# Altium schematic sheet onV1.SchDoc
size A2
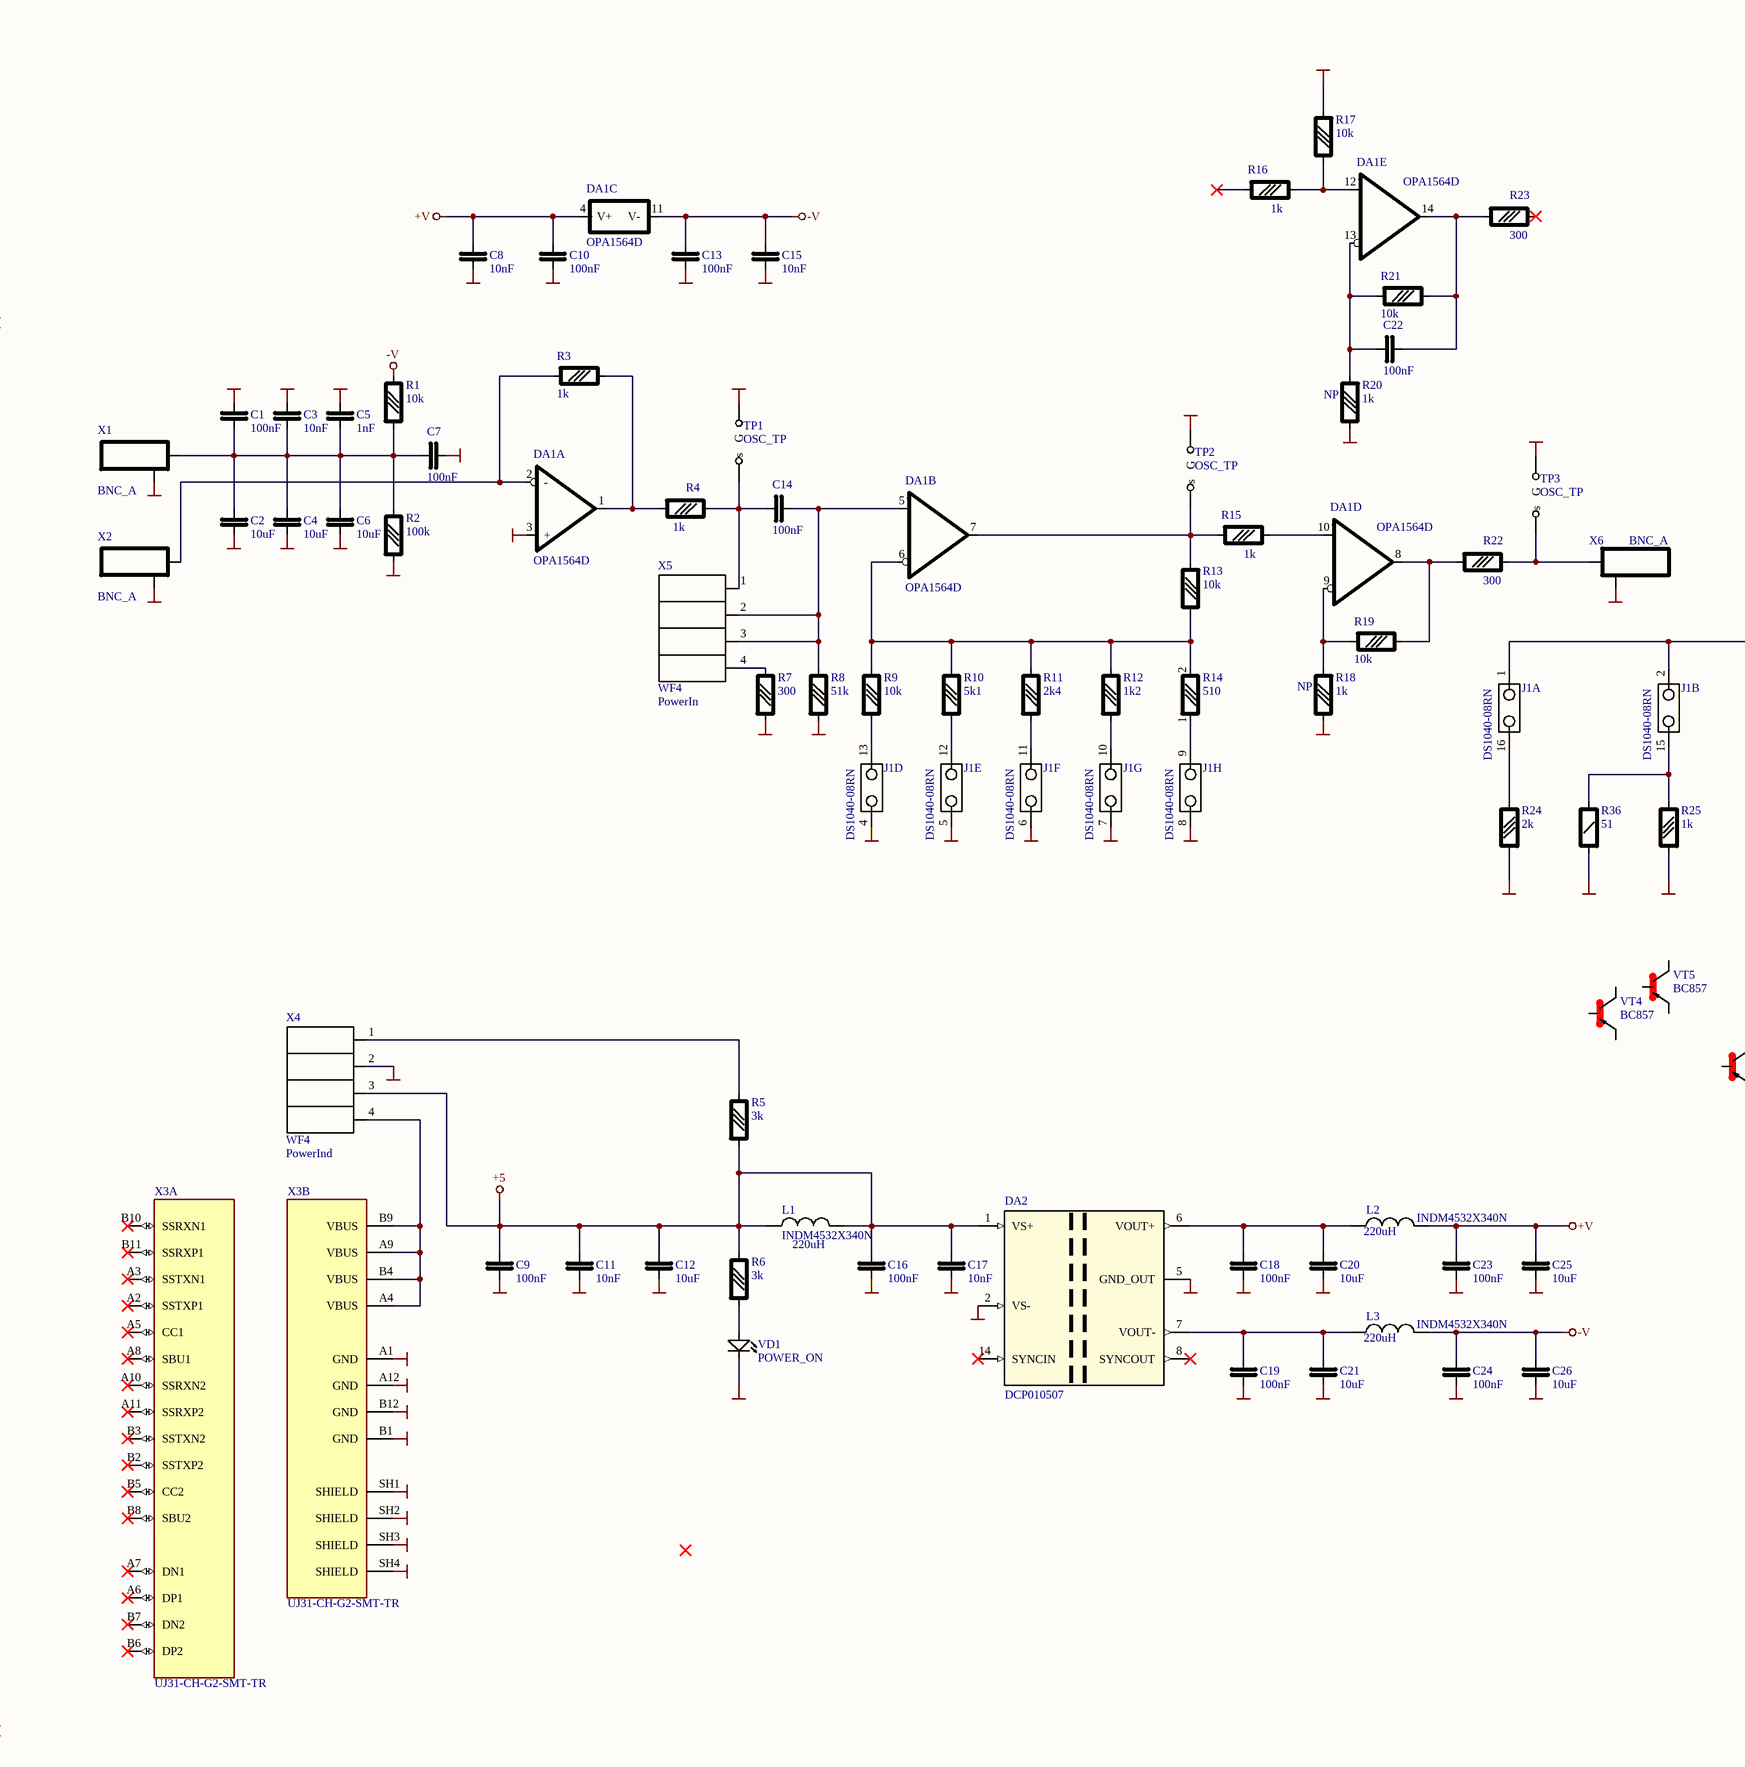
[diagram p0: onV1.SchDoc, left]
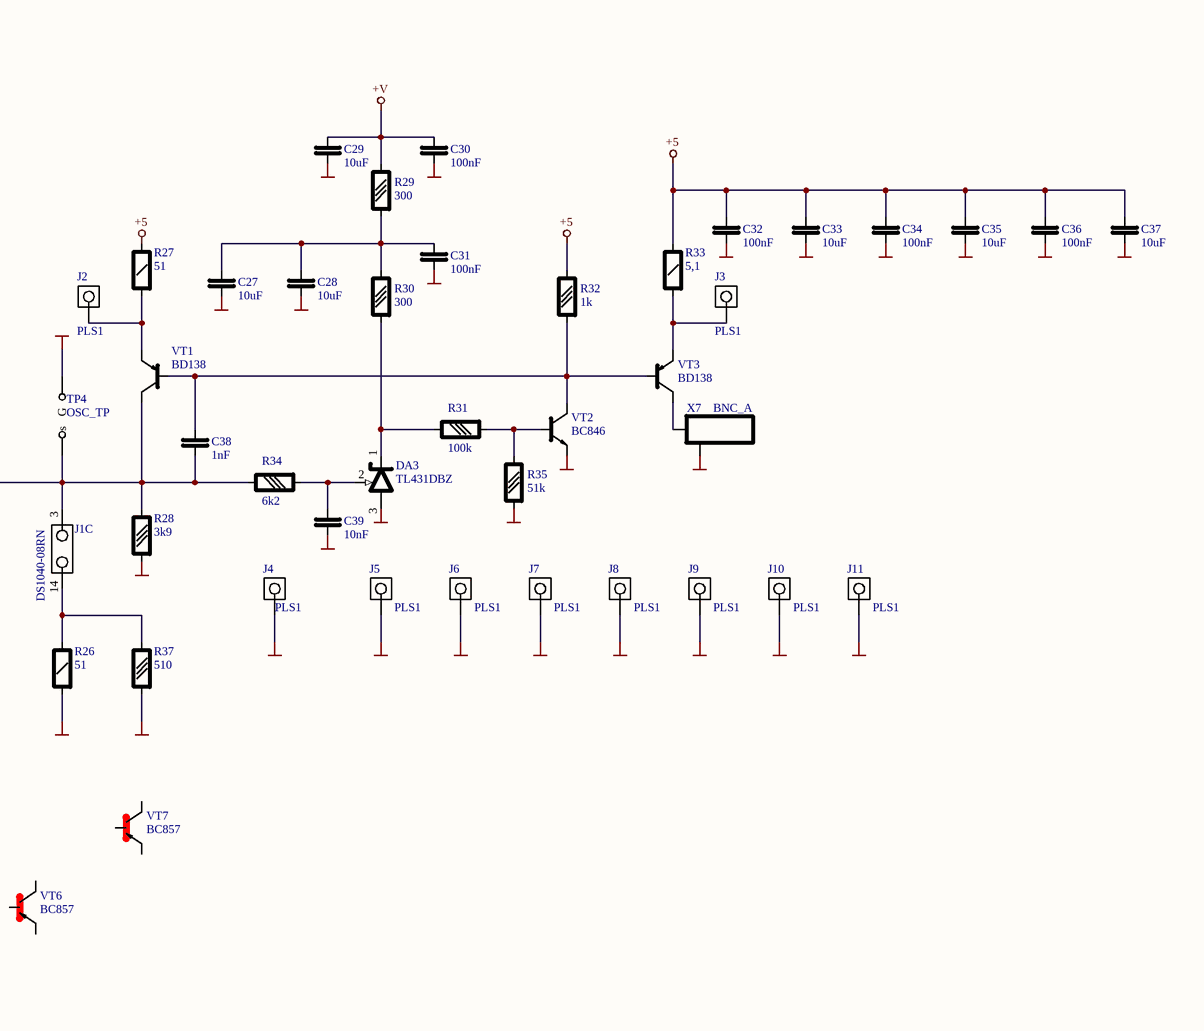
[diagram p1: onV1.SchDoc, right]

## Parts
C1  100nF  [CAPC1608X87N]
C2  10uF  [SMD0805CAP]
C3  10nF  [CAPC1608X87N]
C4  10uF  [SMD0805CAP]
C5  1nF  [CAPC1608X87N]
C6  10uF  [SMD0805CAP]
C7  100nF  [CAPC1608X87N]
C8  10nF  [CAPC1608X87N]
C9  100nF  [CAPC1608X87N]
C10  100nF  [CAPC1608X87N]
C11  10nF  [CAPC1608X87N]
C12  10uF  [SMD0805CAP]
C13  100nF  [CAPC1608X87N]
C14  100nF  [CAPC1608X87N]
C15  10nF  [CAPC1608X87N]
C16  100nF  [CAPC1608X87N]
C17  10nF  [CAPC1608X87N]
C18  100nF  [CAPC1608X87N]
C19  100nF  [CAPC1608X87N]
C20  10uF  [SMD0805CAP]
C21  10uF  [SMD0805CAP]
C22  100nF  [CAPC1608X87N]
C23  100nF  [CAPC1608X87N]
C24  100nF  [CAPC1608X87N]
C25  10uF  [SMD0805CAP]
C26  10uF  [SMD0805CAP]
C27  10uF  [SMD0805CAP]
C28  10uF  [SMD0805CAP]
C29  10uF  [SMD0805CAP]
C30  100nF  [CAPC1608X87N]
C31  100nF  [CAPC1608X87N]
C32  100nF  [CAPC1608X87N]
C33  10uF  [SMD0805CAP]
C34  100nF  [CAPC1608X87N]
C35  10uF  [SMD0805CAP]
C36  100nF  [CAPC1608X87N]
C37  10uF  [SMD0805CAP]
C38  1nF  [CAPC1608X87N]
C39  10nF  [CAPC1608X87N]
DA1  OPA1564D  [SOIC14]  (parts A,B,C,D,E of 5)
DA2  DCP010507  [NVA7]
DA3  TL431DBZ  [SOT-23]
J1  DS1040-08RN  [DIP16-300 W]  (parts A,B,C,D,E,F,G,H of 8)
J2  PLS1  [PLS1]
J3  PLS1  [PLS1]
J4  PLS1  [PLS1]
J5  PLS1  [PLS1]
J6  PLS1  [PLS1]
J7  PLS1  [PLS1]
J8  PLS1  [PLS1]
J9  PLS1  [PLS1]
J10  PLS1  [PLS1]
J11  PLS1  [PLS1]
L1  INDM4532X340N  Inductance: 220uH  [INDM4532X340N]
L2  INDM4532X340N  Inductance: 220uH  [INDM4532X340N]
L3  INDM4532X340N  Inductance: 220uH  [INDM4532X340N]
R1  10k  [RESC1608X64N]
R2  100k  [RESC1608X64N]
R3  1k  [RESC1608X64N]
R4  1k  [RESC1608X64N]
R5  3k  [RESC1608X64N]
R6  3k  [RESC1608X64N]
R7  300  [RESC1608X64N]
R8  51k  [RESC1608X64N]
R9  10k  [RESC1608X64N]
R10  5k1  [RESC1608X64N]
R11  2k4  [RESC1608X64N]
R12  1k2  [RESC1608X64N]
R13  10k  [RESC1608X64N]
R14  510  [RESC1608X64N]
R15  1k  [RESC1608X64N]
R16  1k  [RESC1608X64N]
R17  10k  [RESC1608X64N]
R18  1k  SolderOption: NP  [RESC1608X64N]
R19  10k  [RESC1608X64N]
R20  1k  SolderOption: NP  [RESC1608X64N]
R21  10k  [RESC1608X64N]
R22  300  [RESC1608X64N]
R23  300  [RESC1608X64N]
R24  2k  [RESC1608X64N]
R25  1k  [RESC1608X64N]
R26  51  [RES1206]
R27  51  [RES1206]
R28  3k9  [RESC1608X64N]
R29  300  [RESC1608X64N]
R30  300  [RESC1608X64N]
R31  100k  [RESC1608X64N]
R32  1k  [RESC1608X64N]
R33  5,1  [RES1206]
R34  6k2  [RESC1608X64N]
R35  51k  [RESC1608X64N]
R36  51  [RES1206]
R37  510  [RESC1608X64N]
TP1  OSC_TP  [TP2]
TP2  OSC_TP  [TP2]
TP3  OSC_TP  [TP2]
TP4  OSC_TP  [TP2]
VD1  POWER_ON  [LED0603]
VT1  BD138  [TO229P780X300X1364-3]
VT2  BC846  [SOT-23]
VT3  BD138  [TO229P780X300X1364-3]
VT4  BC857  [SOT-23]
VT5  BC857  [SOT-23]
VT6  BC857  [SOT-23]
VT7  BC857  [SOT-23]
X1  BNC_A  [TYCO_1-1337542-0]
X2  BNC_A  [TYCO_1-1337542-0]
X3  UJ31-CH-G2-SMT-TR  [CUI_UJ31-CH-G2-SMT-TR]  (parts A,B of 2)
X4  WF4  ConnectTo: PowerInd  [MOLEX_22-27-2041]
X5  WF4  ConnectTo: PowerIn  [MOLEX_22-27-2041]
X6  BNC_A  [TYCO_1-1337542-0]
X7  BNC_A  [TYCO_1-1337542-0]

## Nets
+5: C9.2 C11.2 C12.2 C16.2 C17.2 C32.2 C33.2 C34.2 C35.2 C36.2 C37.2 DA2.1(VS+) L1.1 L1.2 R5.1 R6.2 R27.2 R32.2 R33.2 X4.3
+V: C8.2 C10.2 C23.2 C25.2 C29.2 C30.2 DA1.4(V+) L2.2 R29.2
-V: C13.2 C15.2 C24.2 C26.2 DA1.11(V-) L3.2 R1.2
GND: C1.2 C2.1 C3.2 C4.1 C5.2 C6.1 C7.2 C8.1 C9.1 C10.1 C11.1 C12.1 C13.1 C15.1 C16.1 C17.1 C18.1 C19.1 C20.1 C21.1 C23.1 C24.1 C25.1 C26.1 C27.1 C28.1 C29.1 C30.1 C31.1 C32.1 C33.1 C34.1 C35.1 C36.1 C37.1 C39.1 DA1.3(+) DA2.2(VS-) DA2.5(GND_OUT) DA3.3(A) J1.4 J1.5 J1.6 J1.7 J1.8 J4.1 J5.1 J6.1 J7.1 J8.1 J9.1 J10.1 J11.1 R2.1 R7.1 R8.1 R17.1 R18.2 R20.2 R24.1 R25.1 R26.1 R28.1 R35.1 R36.1 R37.1 TP1.2(G) TP2.2(G) TP3.2(G) TP4.2(G) VD1.1(Cathode) VT2.2(Emitter) X1.2 X2.2 X3.A1(GND) X3.A12(GND) X3.B1(GND) X3.B12(GND) X3.SH1(SHIELD) X3.SH2(SHIELD) X3.SH3(SHIELD) X3.SH4(SHIELD) X4.2 X6.2 X7.2
NetC1_1: C1.1 C2.2 C3.1 C4.2 C5.1 C6.2 C7.1 R1.1 R2.2 X1.1
NetC14_1: C14.1 R4.2 TP1.1(s) X5.1
NetC14_2: C14.2 DA1.5(+) R8.2 X5.2 X5.3
NetC18_2: C18.2 C20.2 DA2.6(VOUT+) L2.1
NetC19_2: C19.2 C21.2 DA2.7(VOUT-) L3.1
NetC22_1: C22.1 DA1.13(-) R20.1 R21.1
NetC22_2: C22.2 DA1.14(OUT) R21.2 R23.1
NetC27_2: C27.2 C28.2 C31.2 R29.1 R30.2
NetC38_1: C38.1 J1.1 J1.2 J1.3 R28.2 R34.2 TP4.1(s) VT1.2(Collector)
NetC38_2: C38.2 R32.1 VT1.3(Base) VT2.3(Collector) VT3.3(Base)
NetC39_2: C39.2 DA3.2(Ref) R34.1
NetDA1_1: DA1.1(OUT) R3.2 R4.1
NetDA1_2: DA1.2(-) R3.1 X2.1
NetDA1_6: DA1.6(-) R9.2 R10.2 R11.2 R12.2 R13.2 R14.2
NetDA1_7: DA1.7(OUT) R13.1 R15.1 TP2.1(s)
NetDA1_8: DA1.8(OUT) R19.2 R22.1
NetDA1_9: DA1.9(-) R18.1 R19.1
NetDA1_10: DA1.10(+) R15.2
NetDA1_12: DA1.12(+) R16.2 R17.2
NetDA3_1: DA3.1(C) R30.1 R31.2
NetJ1_9: J1.9 R14.1
NetJ1_10: J1.10 R12.1
NetJ1_11: J1.11 R11.1
NetJ1_12: J1.12 R10.1
NetJ1_13: J1.13 R9.1
NetJ1_14: J1.14 R26.2 R37.2
NetJ1_15: J1.15 R25.2 R36.2
NetJ1_16: J1.16 R24.2
NetJ2_1: J2.1 R27.1 VT1.1(Emitter)
NetJ3_1: J3.1 R33.1 VT3.1(Emitter)
NetR5_2: R5.2 X4.1
NetR6_1: R6.1 VD1.2(Anode)
NetR7_2: R7.2 X5.4
NetR22_2: R22.2 TP3.1(s) X6.1
NetR31_1: R31.1 R35.2 VT2.1(base)
NetVT3_2: VT3.2(Collector) X7.1
NetX3_A4: X3.A4(VBUS) X3.A9(VBUS) X3.B4(VBUS) X3.B9(VBUS) X4.4

Not connected (* = marked no-connect by the designer): DA2 8(SYNCOUT)* 14(SYNCIN)*; R16 1*; R23 2*; VT4 1(base) 2(Emitter) 3(Collector); VT5 1(base) 2(Emitter) 3(Collector); VT6 1(base) 2(Emitter) 3(Collector); VT7 1(base) 2(Emitter) 3(Collector); X3 A2(SSTXP1)* A3(SSTXN1)* A5(CC1)* A6(DP1)* A7(DN1)* A8(SBU1)* A10(SSRXN2)* A11(SSRXP2)* B2(SSTXP2)* B3(SSTXN2)* B5(CC2)* B6(DP2)* B7(DN2)* B8(SBU2)* B10(SSRXN1)* B11(SSRXP1)*

## Library data of the parts
C1 C3 C5 C7-C11 C13-C19 C22-C24 C30-C32 C34 C36 C38 C39 = C0603: Чип конденсатор 0603; Voltage: 50V; Vendor: Generic; DielectricType: Y5V; Tol: 20%; SolderOption: Norm; Price: 2
  C1 C7 C9 C10 C13 C14 C16 C18 C19 C22-C24 C30-C32 C34 C36: Value: 100nF
  C3 C8 C11 C15 C17 C39: Value: 10nF
  C5 C38: Value: 1nF
C2 C4 C6 C12 C20 C21 C25-C29 C33 C35 C37 = C0805: Чип конденсатор 0805; Voltage: 50V; Vendor: Generic; DielectricType: Y5V; Tol: 20%; SolderOption: Norm; Value: 10uF; Price: 2
DA1 = OPA1564D: счетверённый ОУ JFED; Vendor: Texas Instruments; Voltage: 4.5V.. 36V/+-2.25..+-18V; Bandwidth: 18MHz; SolderOption: Norm; Value: OPA1564D; Price: 800
DA2 = DCP010507: DC/DC 5V to isolated +-7V; Vendor: Texas Instruments; Copyright: Copyright (C) 2022 Ultra Librarian. All rights reserved.; Value: DCP010507; Price: 1000
DA3 = TL431DBZ: Adjustable voltage reference; Vendor: TI; Package: SOT23; Unit Price: 1; Value: TL431DBZ
J1 = DS1040-08RN: DIP переключатель 8x2.54; Vendor: Connfly; SolderOption: Norm; Price: 50; Value: DS1040-08RN
J2-J11 = PLS1: Штырь PLS1; SolderOption: Norm; Price: 1; Vendor: *; Value: PLS1
L1-L3 = INDM4532X340N: SMD Дроссель; Vendor: Sumida; Curent: 0.5A; Price: 100; Value: INDM4532X340N
R1-R4 R7-R17 R19 R21-R25 R28-R32 R34 R35 R37 = R0603: Чип резистор 0603; Vendor: Generic; Tolerance: 5%; SolderOption: Norm; TC: +-100ppm/C; Price: 2
  R1 R9 R13 R17 R19 R21: Value: 10k
  R2 R31: Value: 100k
  R3 R4 R15 R16 R25 R32: Value: 1k
  R7 R22 R23 R29 R30: Value: 300
  R8 R35: Value: 51k
  R10: Value: 5k1
  R11: Value: 2k4
  R12: Value: 1k2
  R14 R37: Value: 510
  R24: Value: 2k
  R28: Value: 3k9
  R34: Value: 6k2
R5 R6 = R0603: Чип резистор 0603; Vendor: Generic; Tolerance: 5%; TC: +-100ppm/C; SolderOption: Norm; Price: 2; Value: 3k
R18 R20 = R0603: Чип резистор 0603; Vendor: Generic; Tolerance: 5%; TC: +-100ppm/C; Price: 2; Value: 1k
R26 R27 R33 R36 = R1206: Чип резистор 1206; Vendor: Generic; Tolerance: 5%; TC: +-100ppm/C; SolderOpton: Norm; Price: 2
  R26 R27 R36: Value: 51
  R33: Value: 5,1
TP1-TP4 = OscTP: Контрольная точка для подключения осциллографа короткой землёй; Vendor: PCB; Price: 0; Value: OSC_TP; SolderOption: PCB
VD1 = LED0603: Чип светодиод 0603; Vendor: KB; Color: Green; SolderOpton: Norm; Price: 20; Value: POWER_ON
VT1 VT3 = BD138: PNP  средней мощности (КГ814); Vendor: OneSemi; Voltage: 40-100; SolderOption: Norm; Value: BD138; Price: 50
VT2 = BC846: NPN транзистор; Vendor: NXP; Voltage: 65V; SolderOption: Norm; Value: BC846; Price: 25
VT4-VT7 = BC857: PNP транзистор; Vendor: NXP; Voltage: 65V; SolderOption: Norm; Value: BC857; Price: 25
X1 X2 X6 X7 = BNC_A: BNC розетка; Vendor: TYCO; SolderOption: Norm; Price: 500; Value: BNC_A; ConnectTo: *; PartNum: TYCO_1-1337542-0
X3 = UJ31-CH-G2-SMT-TR: Type C, USB 3.1 Gen 2, 5 A, Right Angle, Surface Mount (SMT), USB Receptacle; Value: USB Type-C; MF: CUI Devices; Package: None; Part_N: UJ31-CH-G2-SMT-TR; Purchase-URL: https://pricing.snapeda.com/search/part/UJ31-CH-G2-SMT-TR/?ref=eda; Check_prices: https://www.snapeda.com/parts/UJ31-CH-G2-SMT-TR/CUI+Devices/view-part/?ref=eda; CUI_purchase_URL: https://www.cuidevices.com/product/interconnect/connectors/usb-connectors/uj31-ch-g2-smt-tr?utm_source=snapeda.com&utm_medium=referral&utm_campaign=snapedaBOM; Price: 75; SnapEDA_Link: https://www.snapeda.com/parts/UJ31-CH-G2-SMT-TR/CUI+Devices/view-part/?ref=snap
X4 X5 = WF4: Вилка  WF4x2.54; Vendor: Confly; SolderOption: Norm; Price: 25; Value: WF4
  X4: Parameter 1: *